# Altium schematic sheet DSO_Power.SchDoc: Schematic_Name
size A4; CompanyName: University of Melbourne; Engineer: Your Name Here; DocumentNumber: 1; Revision: 0.1; SheetNumber: 1; SheetTotal: 1; Title_Project: Project_Title; StudentNo: Student No.
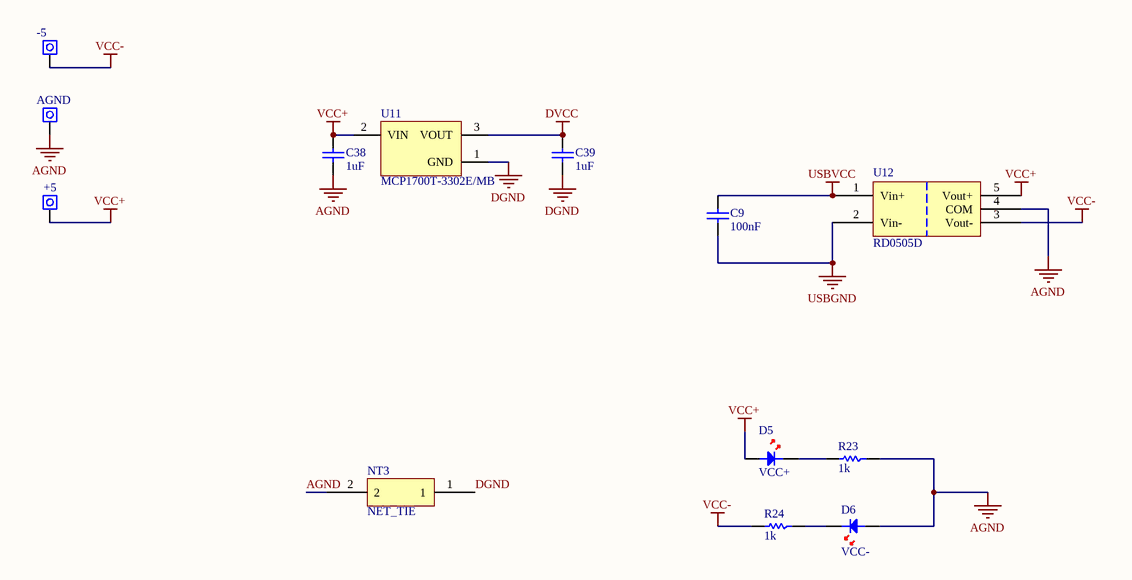
[diagram p0: DSO_Power.SchDoc]

## Parts
C9  100nF  [0805C]
C38  1uF  [0805C]
C39  1uF  [0805C]
D5  VCC+  [0805D-RED]
D6  VCC-  [0805D-RED]
NT3  NET_TIE  [NET_TIE]  (net tie, no BOM)
R23  1k  [0805]
R24  1k  [0805]
TP4  -5  [PIN 1.8mm]
TP5  AGND  [PIN 1.8mm]
TP6  +5  [PIN 1.8mm]
U11  MCP1700T-3302E/MB  [SOT89]
U12  RD0505D  [SIP_NMG]

## Nets
AGND: C38.2 D6.A NT3.2 R23.1 TP5.1 U12.4(COM)
DGND: C39.2 NT3.1 U11.1(GND)
DVCC: C39.1 U11.3(VOUT)
USBGND: C9.2 U12.2(Vin-)
USBVCC: C9.1 U12.1(Vin+)
VCC+: C38.1 D5.A TP6.1 U11.2(VIN) U12.5(Vout+)
VCC-: R24.2 TP4.1 U12.3(Vout-)
NetD5_K: D5.K R23.2
NetD6_K: D6.K R24.1

## Library data of the parts
C9 C38 C39 = C: Capacitor; Reviewed by: RM - 2018/08/05; Revision: July-2002: Re-released for DXP Platform.; Supplier 1: *; Supplier Part Number 1: *
  C9: Value: 100nF
  C38 C39: Value: 1uF
D5 D6 = LED RED: Light Emitting Diode; Reviewed by: RM - 2018/08/05; Revision: July-2002: Re-released for DXP Platform.; Supplier 1: Digi-Key; Supplier Part Number 1: 475-1415-1-ND
NT3 = NET_TIE: Net Tie
R23 R24 = R: Resistor; Value: 1k
TP4-TP6 = WIRE: Pad
U11 = MCP1700T: Low Quiescent Current LDO, 3-Pin SOT-89, Extended Temperature, Tape and Reel; Reviewed by: RM - 2018/08/05; Supplier 1: Digi-Key; Supplier Part Number 1: MCP1700T3302EMBCT-ND
U12 = RD0505D: (ADV) DC to DC converter 5V in +-5V out; Reviewed by: RM - 2018/08/05; Supplier Part Number 1: 945-1136-ND; Supplier 1: Digi-Key